# EasyEDA Pro project ACAC.eprj

# Schematic Schematic1
Board Name: Board1; Create Date: 2025-05-16
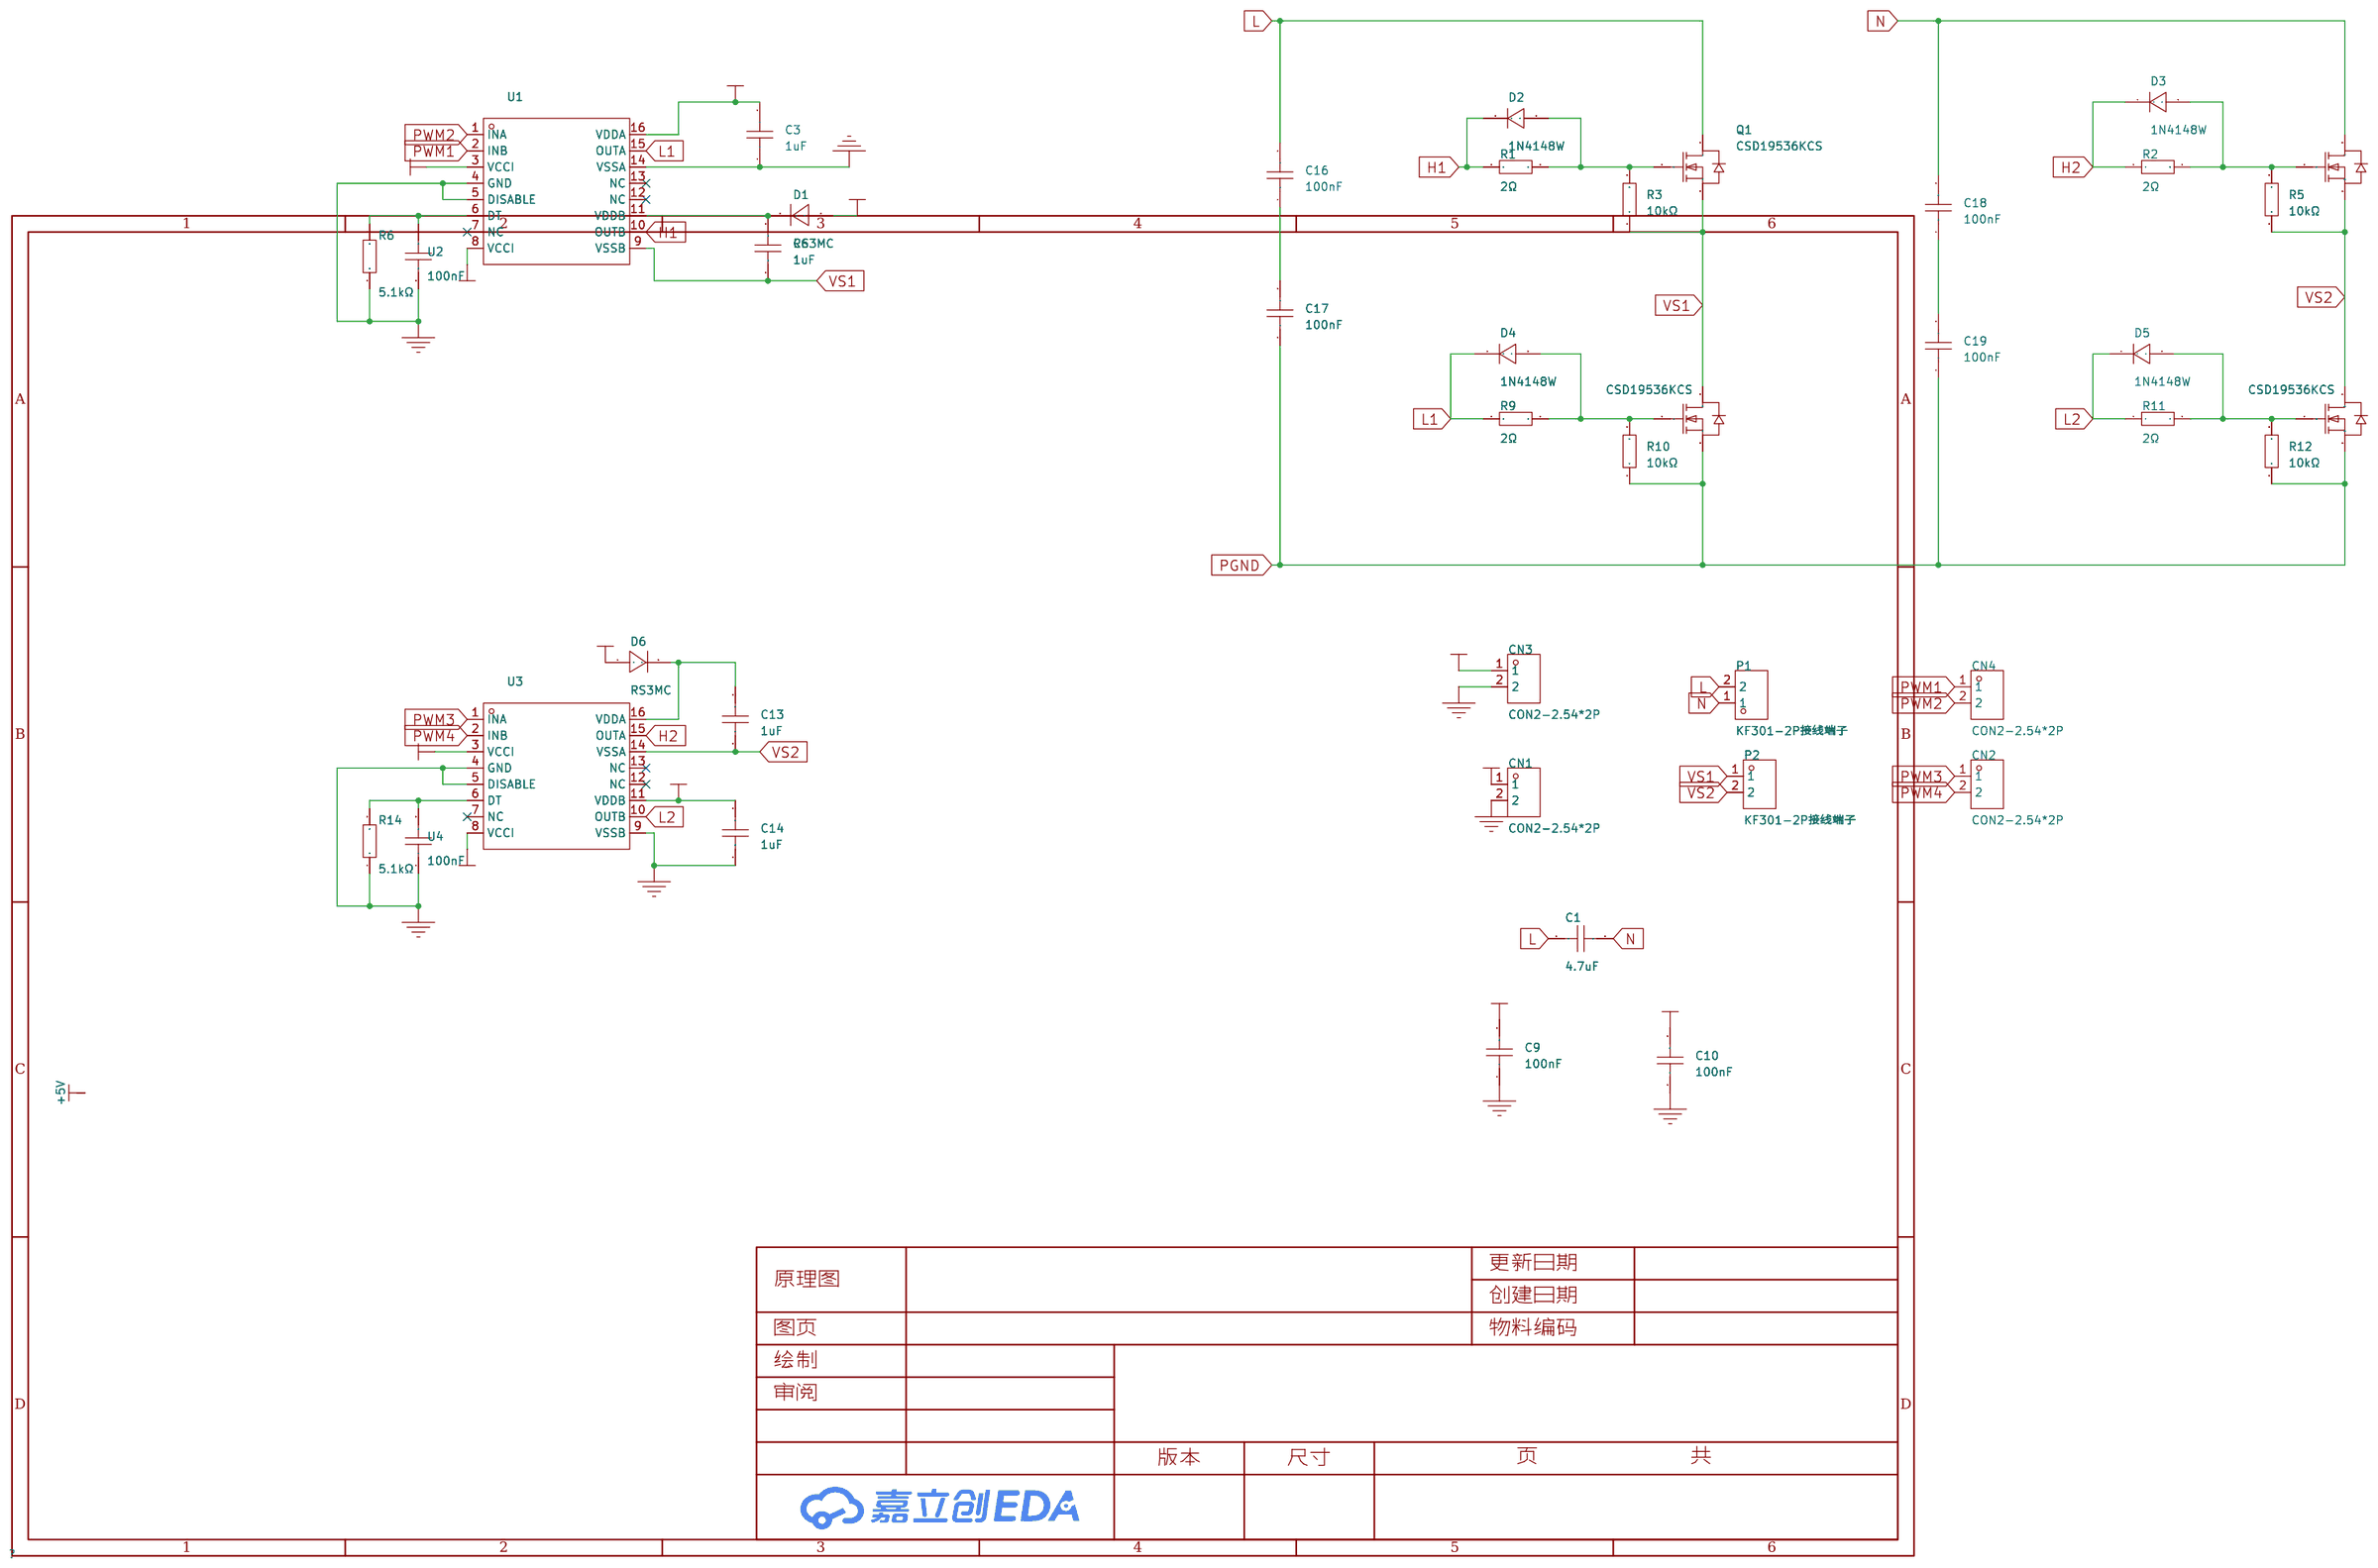
[diagram p0: schematic sheet]

## Parts
C1  4.7uF  [CAP-TH_L27.5-W12.0-P25.00-D1.0]
C3  1uF  [C0805]
C6  1uF  [C0805]
C9  100nF  [C0805]
C10  100nF  [C0805]
C13  1uF  [C0805]
C14  1uF  [C0805]
C16  100nF  [C0805]
C17  100nF  [C0805]
C18  100nF  [C0805]
C19  100nF  [C0805]
CN1  CON2-2.54*2P  [CONN-TH_2P-P2.54-V]
CN2  CON2-2.54*2P  [CONN-TH_2P-P2.54-V]
CN3  CON2-2.54*2P  [CONN-TH_2P-P2.54-V]
CN4  CON2-2.54*2P  [CONN-TH_2P-P2.54-V]
D1  RS3MC  [SMC_L7.1-W6.2-LS8.1-R-RD]
D2  1N4148W  [SOD-123F_L2.7-W1.6-LS3.8-RD]
D3  1N4148W  [SOD-123F_L2.7-W1.6-LS3.8-RD]
D4  1N4148W  [SOD-123F_L2.7-W1.6-LS3.8-RD]
D5  1N4148W  [SOD-123F_L2.7-W1.6-LS3.8-RD]
D6  RS3MC  [SMC_L7.1-W6.2-LS8.1-R-RD]
P1  KF301-2P接线端子  [CONN-TH_XY301V-A-5.0-2P]
P2  KF301-2P接线端子  [CONN-TH_XY301V-A-5.0-2P]
Q1  CSD19536KCS  [TO-220-3_L10.0-W4.5-P2.54-L]
Q2  CSD19536KCS  [TO-220-3_L10.0-W4.5-P2.54-L]
Q3  CSD19536KCS  [TO-220-3_L10.0-W4.5-P2.54-L]
Q4  CSD19536KCS  [TO-220-3_L10.0-W4.5-P2.54-L]
R1  2Ω  [R0805]
R2  2Ω  [R0805]
R3  10kΩ  [R0805]
R5  10kΩ  [R0805]
R6  20kΩ  [R0805]
R9  2Ω  [R0805]
R10  10kΩ  [R0805]
R11  2Ω  [R0805]
R12  10kΩ  [R0805]
R14  20kΩ  [R0805]
U1  UCC21520  [SOIC-16_L10.3-W7.5-P1.27-LS10.3-BL]
U2  100nF  [C0805]
U3  UCC21520  [SOIC-16_L10.3-W7.5-P1.27-LS10.3-BL]
U4  100nF  [C0805]

## Library data of the parts
C1 = KP475K2G2501: 容值:4.7uF;精度:±10%;额定电压:400V;工作温度:-40℃~+100℃;; LCSC Part Name: 4.7uF ±10% 400V; Supplier Part: C3019079; Manufacturer: KYET(科雅); Supplier Footprint: 插件,P=25mm; JLCPCB Part Class: 扩展库; Datasheet: https://atta.szlcsc.com/upload/public/pdf/source/20220523/87D483915523636C76AB2708979E5C62.pdf; Supplier: LCSC; Tolerance: ±10%; Voltage Rating: 400V; Operating Temperature: -40℃~+100℃
C3 C6 C9 C10 C13 C14 C16-C19 = CAP_0805: Supplier Footprint: 0805
CN1-CN4 = CON2-2.54*2P: Supplier Part: C9900003238; Supplier Footprint: TH-2P; JLCPCB Part Class: Extended Part; Supplier: LCSC
D1 D6 = RS3MC_C15283: 二极管配置:独立式;正向压降(Vf):1.3V@3A;直流反向耐压(Vr):1kV;整流电流:3A;反向恢复时间(trr):500ns;; LCSC Part Name: 电压:1kV 电流:3A; Supplier Part: C15283; Manufacturer: MDD(辰达半导体); Supplier Footprint: SMC; JLCPCB Part Class: 扩展库; Datasheet: https://atta.szlcsc.com/upload/public/pdf/source/20240809/311FA8487617F5AA976E3BC15CA3A541.pdf; Supplier: LCSC; Diode Configuration: 独立式; Forward Voltage (Vf@If): 1.3V@3A; Reverse Voltage (Vr): 1kV; Rectified Current: 3A; Reverse Leakage Current: 5uA@1kV; Reverse Recovery Time (trr): 500ns; Operating Temperature: -55℃~+150℃@(Tj)
D2-D5 = 1N4148W_C81598: 二极管配置:独立式;正向压降(Vf):1V@50mA;直流反向耐压(Vr):75V;平均整流电流(Io):150mA;功率:400mW;反向恢复时间(trr):4ns;; LCSC Part Name: 电压:75V 电流:150mA; Supplier Part: C81598; Manufacturer: ST(先科); Supplier Footprint: SOD-123; JLCPCB Part Class: Basic Part; Datasheet: https://atta.szlcsc.com/upload/public/pdf/source/20161024/1477288446905.pdf; Supplier: LCSC; Diode Configuration: 独立式; Forward Voltage (Vf@If): 1V@50mA; Reverse Voltage (Vr): 75V; Average Rectified Current (Io): 150mA; Power Dissipation: 400mW; Reverse Leakage Current: 1uA@75V; Reverse Recovery Time (trr): 4ns
P1 P2 = KF301-2P接线端子: Supplier Part: C9900016950; Supplier Footprint: CK301-2P; JLCPCB Part Class: Extended Part; Supplier: LCSC
Q1-Q4 = CSD19536KCS: LCSC Part Name: 1个N沟道 耐压:100V 电流:150A; Supplier Part: C206030; Manufacturer: TI(德州仪器); Supplier Footprint: TO-220; JLCPCB Part Class: 扩展库; Datasheet: https://www.ti.com/cn/lit/gpn/csd19536kcs; Supplier: LCSC; Type: 1个N沟道; Drain Source Voltage (Vdss): 100V; Continuous Drain Current (Id): 150A; Power Dissipation (Pd): 375W; Drain Source On Resistance (RDS(on)@Vgs,Id): 2.7mΩ@10V,100A; Gate Threshold Voltage (Vgs(th)@Id): 3.2V@250uA; Total Gate Charge (Qg@Vgs): 153nC@10V; Input Capacitance (Ciss@Vds): 12nF@50V; Operating Temperature: -55℃~+175℃@(Tj)
R1-R3 R5 R9-R12 = Res_AXIAL-1/8W: Supplier Footprint: 轴向引线
R6 R14 = 20kΩ: 电阻类型:金属膜电阻;阻值:20kΩ;精度:±1%;功率:500mW;温度系数:±50ppm/℃;; LCSC Part Name: 金属膜电阻 20kΩ ±1% 500mW; Supplier Part: C173146; Manufacturer: YAGEO(国巨); Manufacturer Part: MFR50SFTE52-20K; Supplier Footprint: 插件,D2.4xL6.3mm; JLCPCB Part Class: 扩展库; Datasheet: https://atta.szlcsc.com/upload/public/pdf/source/20191118/C457825_18355E864DE4965678DC27B0EBC3E21E.pdf; Supplier: LCSC; Type: 金属膜电阻; Tolerance: ±1%; Power(Watts): 500mW; Temperature Coefficient: ±50ppm/℃; Operating Temperature Range: -55℃~+155℃; Origin Footprint 2: RES-TH_BD2.4-L6.3-P10.30-D0.6; Origin Footprint 1: MFR50SFTE52-20K
U1 U3 = UCC21520: Supplier: LCSC; Supplier Part: C601651; Manufacturer: TI(德州仪器); JLCPCB Part Class: Extended Part
U2 U4 = 1C25X7R473K100B: 容值:47nF;精度:±10%;额定电压:100V;温度系数:X7R;; LCSC Part Name: 47nF ±10% 100V; Supplier Part: C1630512; Manufacturer: VISHAY(威世); Supplier Footprint: 插件,P=6.35mm; JLCPCB Part Class: Extended Part; Datasheet: https://atta.szlcsc.com/upload/public/pdf/source/20210701/0CF1A7AD3406E72B391D35880AF61B15.pdf; Supplier: LCSC; Tolerance: ±10%; Voltage Rated: 100V; Temperature Coefficient: X7R

## Nets
+5V: C9.2 CN1.1 U1.3(VCCI) U1.8(VCCI) U3.3(VCCI) U3.8(VCCI)
+12V: C3.2 C10.2 C14.2 CN3.1 D1.1(A) D6.1(A) U1.16(VDDA) U3.11(VDDB)
DGND: C9.1 CN1.2 R6.1 R14.1 U1.4(GND) U1.5(DISABLE) U2.1 U3.4(GND) U3.5(DISABLE) U4.1
PGND: C3.1 C10.1 C14.1 C17.1 C19.1 CN3.2 Q3.3(S) Q4.3(S) R10.1 R12.1 U1.14(VSSA) U3.9(VSSB)
H1: D2.1(K) R1.1 U1.10(OUTB)
H2: D3.1(K) R2.1 U3.15(OUTA)
L: C1.2 C16.2 P1.2 Q1.2(D)
L1: D4.1(K) R9.1 U1.15(OUTA)
L2: D5.1(K) R11.1 U3.10(OUTB)
N: C1.1 C18.2 P1.1 Q2.2(D)
PWM1: CN4.1 U1.2(INB)
PWM2: CN4.2 U1.1(INA)
PWM3: CN2.1 U3.1(INA)
PWM4: CN2.2 U3.2(INB)
VS1: C6.1 P2.1 Q1.3(S) Q3.2(D) R3.1 U1.9(VSSB)
VS2: C13.1 P2.2 Q2.3(S) Q4.2(D) R5.1 U3.14(VSSA)
$1N12835: D4.2(A) Q3.1(G) R9.2 R10.2
$1N12837: D2.2(A) Q1.1(G) R1.2 R3.2
$1N12839: D3.2(A) Q2.1(G) R2.2 R5.2
$1N12841: D5.2(A) Q4.1(G) R11.2 R12.2
$1N12848: R14.2 U3.6(DT) U4.2
$1N12851: C6.2 D1.2(K) U1.11(VDDB)
$1N12856: R6.2 U1.6(DT) U2.2
$1N12866: C13.2 D6.2(K) U3.16(VDDA)
$1N12879: C16.1 C17.2
$1N13030: C18.1 C19.2

Not connected (* = marked no-connect by the designer): U1 7(NC)* 12(NC)* 13(NC)*; U3 7(NC)* 12(NC)* 13(NC)*

# Board PCB1
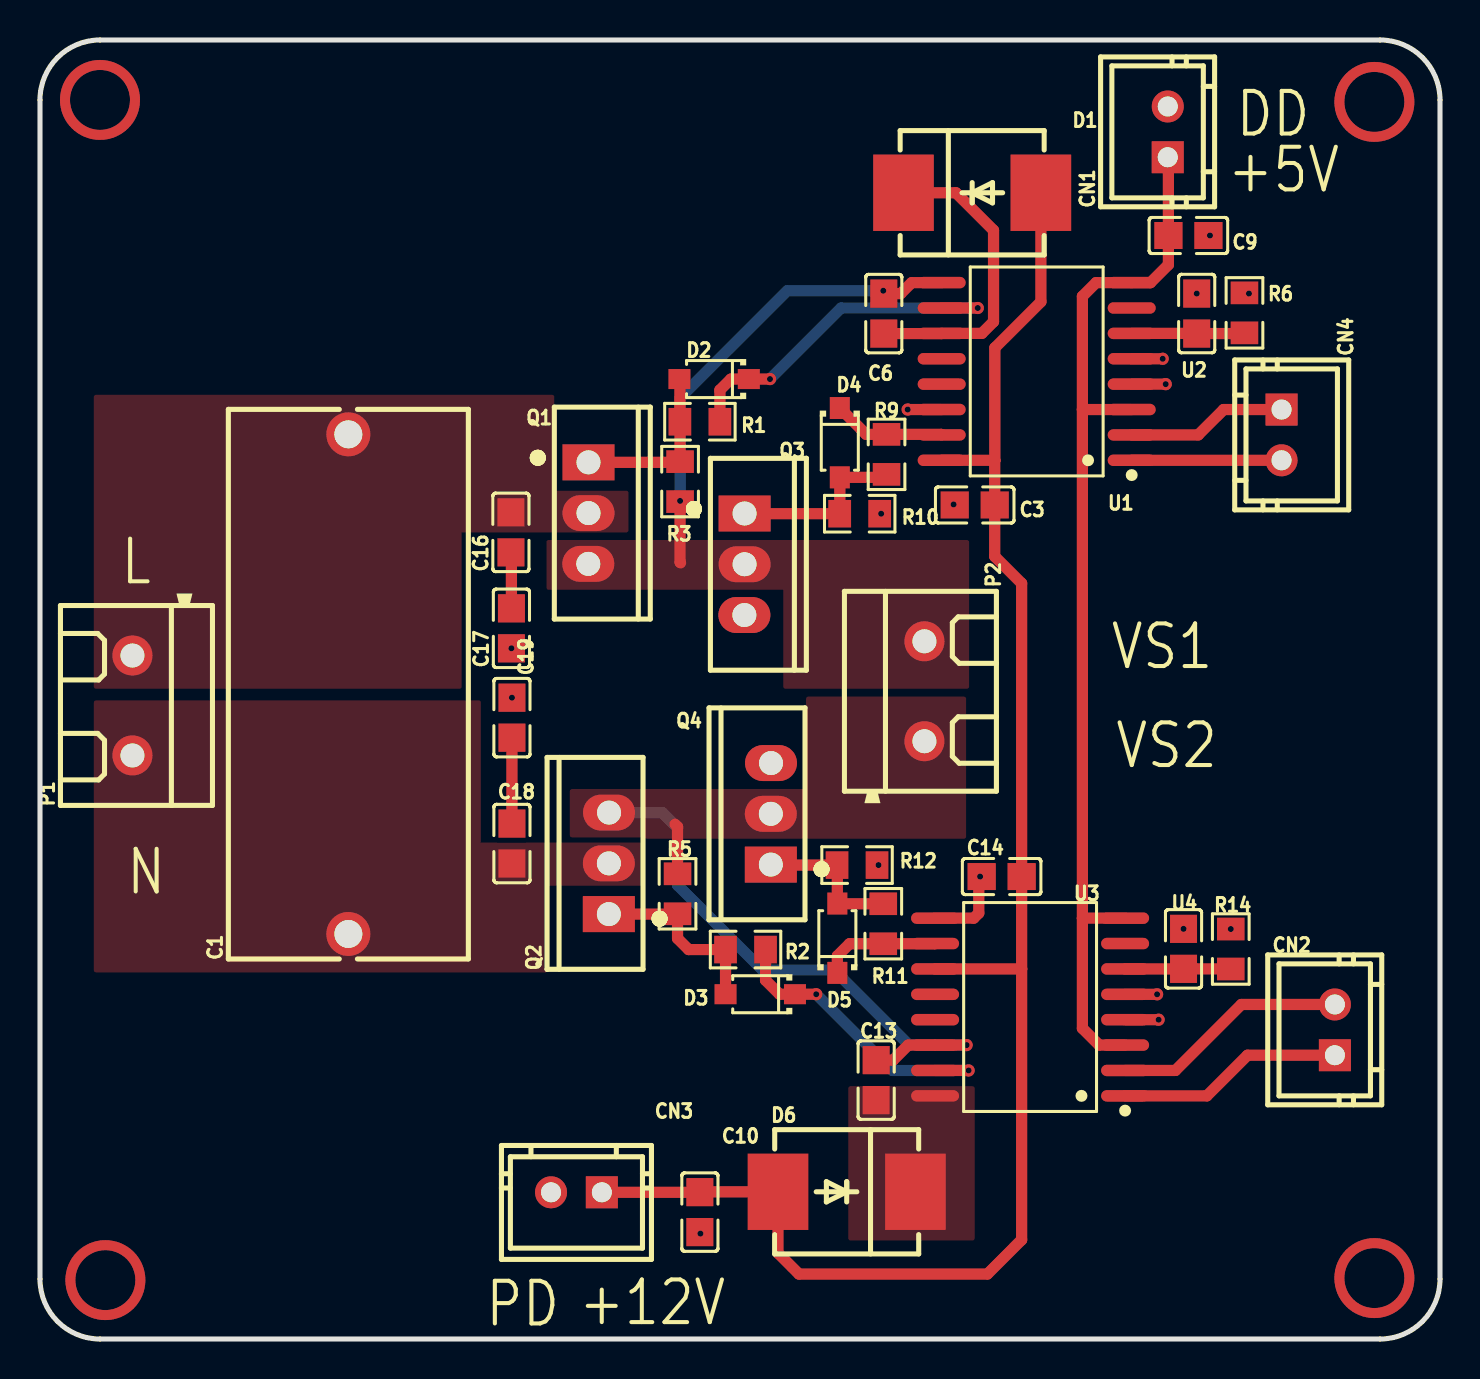
[diagram p1: board, top side]
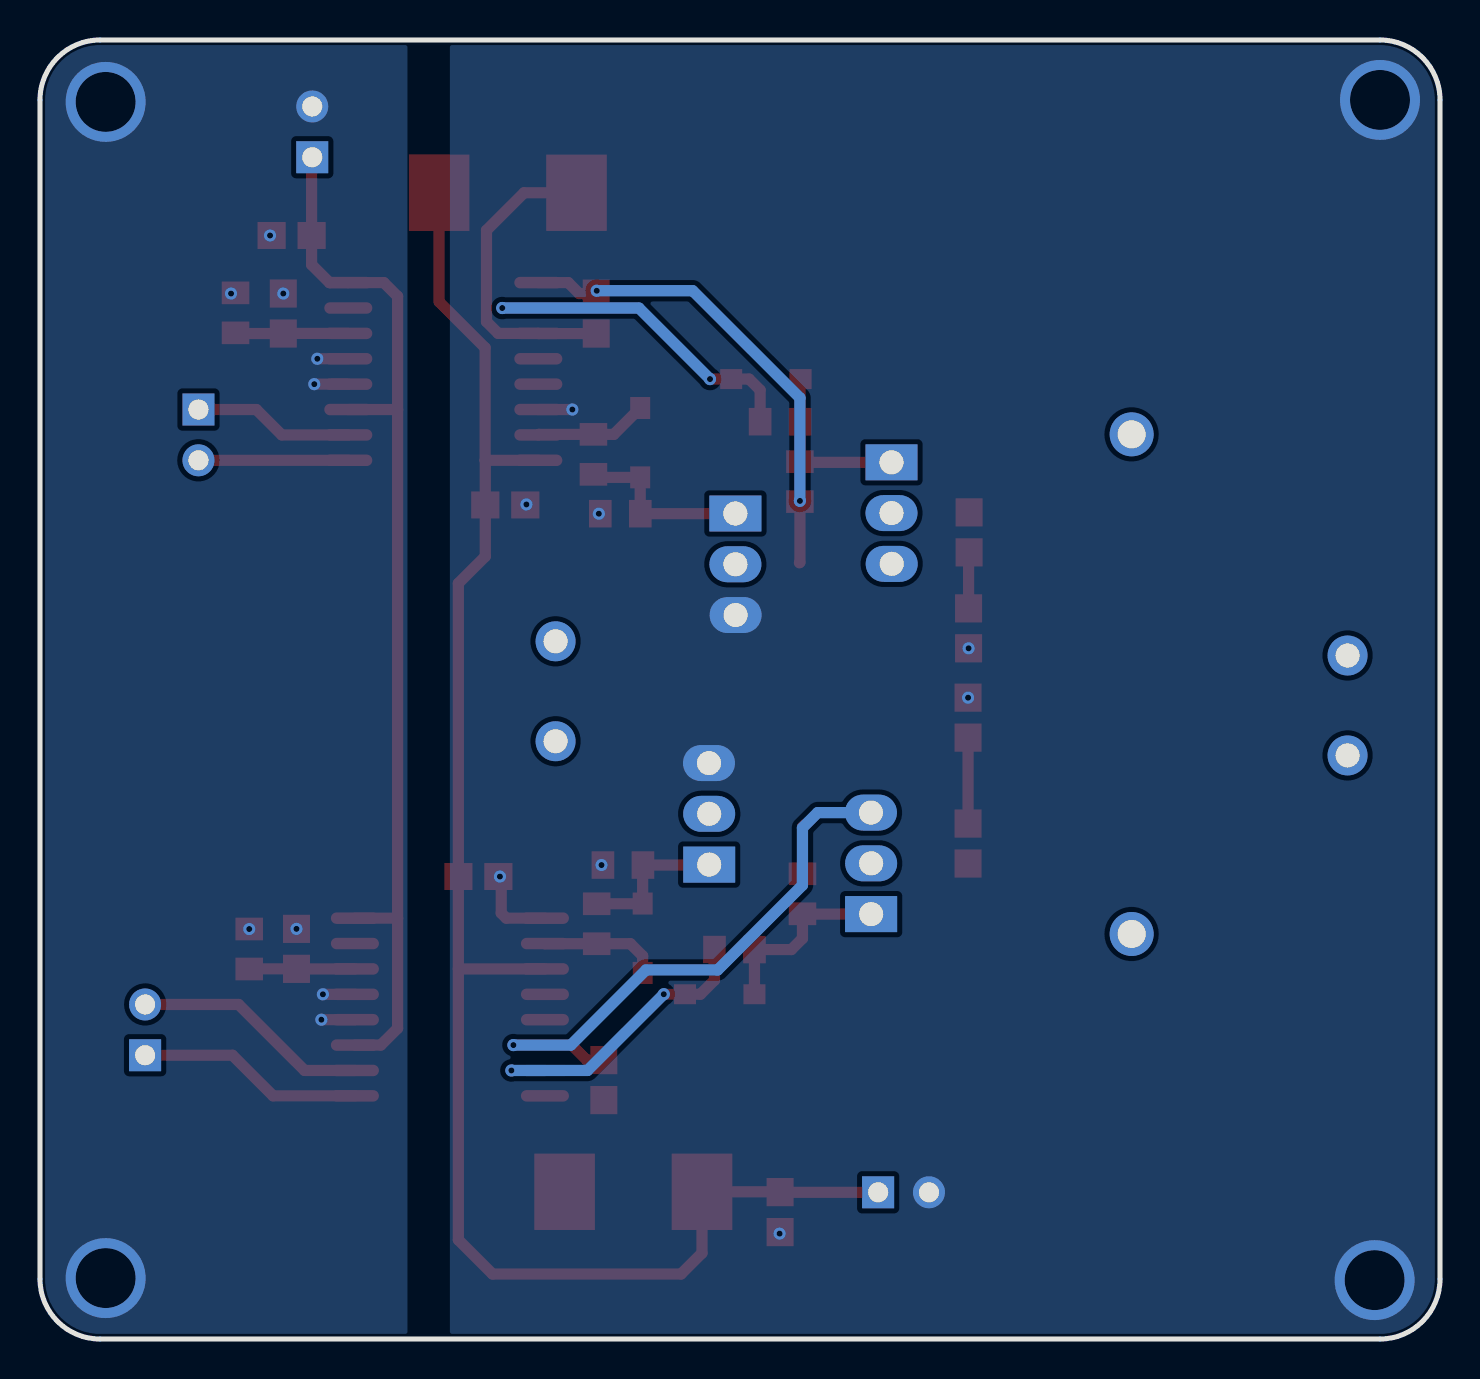
[diagram p2: board, bottom side, seen from below]

Outline 70 x 65 mm; copper layers: Top Layer, Bottom Layer. Coordinates in mm from the lower left corner of the outline.
Outline path: 0,62 0,3 arc(0.88,0.88) 3,0 67,0 arc(69.12,0.88) 70,3 70,62 arc(69.12,64.12) 67,65 3,65 arc(0.88,64.12) 0,62
Stack: Top Layer 0.035mm / Dielectric1 1.51mm FR4 er 4.5 / Bottom Layer 0.035mm

## Design rules (mm)
template: 自定义配置
spacing copperThickness1oz (default): track to track 0.102, other pairs 0.152 to 0.3
spacing copperThickness2oz: track to track 0.203, other pairs 0.152 to 0.3
track width copperThickness1oz (default): min 0.127, default 0.254, max 2.54
track width copperThickness2oz: min 0.203, default 0.254, max 2.54
differential pair differentialPair (default): width min 0.127, default 0.254, max 2.54; gap min 0.152, default 0.152
via viaSize (default): diameter min 0.5, default 0.61, max 10; hole min 0.3, default 0.305, max 6.3

## Placement (name value [footprint] x y rotation side)
C1  4.7uF  [CAP-TH_L27.5-W12.0-P25.00-D1.0]  15.42 32.77 90 top
C3  1uF  [C0805]  46.74 41.73 0 top
C6  1uF  [C0805]  42.19 51.31 270 top
C9  100nF  [C0805]  57.42 55.22 180 top
C10  100nF  [C0805]  32.99 6.35 90 top
C13  1uF  [C0805]  41.81 12.95 270 top
C14  1uF  [C0805]  48.08 23.14 0 top
C16  100nF  [C0805]  23.55 40.36 90 top
C17  100nF  [C0805]  23.57 35.56 90 top
C18  100nF  [C0805]  23.6 24.79 270 top
C19  100nF  [C0805]  23.6 31.09 270 top
CN1  CON2-2.54*2P  [CONN-TH_2P-P2.54-V]  56.39 60.4 90 top
CN2  CON2-2.54*2P  [CONN-TH_2P-P2.54-V]  64.74 15.47 90 top
CN3  CON2-2.54*2P  [CONN-TH_2P-P2.54-V]  26.82 7.34 180 top
CN4  CON2-2.54*2P  [CONN-TH_2P-P2.54-V]  62.08 45.24 270 top
D1  RS3MC  [SMC_L7.1-W6.2-LS8.1-R-RD]  46.61 57.35 0 top
D2  1N4148W  [SOD-123F_L2.7-W1.6-LS3.8-RD]  33.71 48.03 180 top
D3  1N4148W  [SOD-123F_L2.7-W1.6-LS3.8-RD]  36.01 17.25 180 top
D4  1N4148W  [SOD-123F_L2.7-W1.6-LS3.8-RD]  39.99 44.85 270 top
D5  1N4148W  [SOD-123F_L2.7-W1.6-LS3.8-RD]  39.87 20.06 90 top
D6  RS3MC  [SMC_L7.1-W6.2-LS8.1-R-RD]  40.34 7.37 180 top
P1  KF301-2P接线端子  [CONN-TH_XY301V-A-5.0-2P]  4.62 31.7 90 top
P2  KF301-2P接线端子  [CONN-TH_XY301V-A-5.0-2P]  44.22 32.41 270 top
Q1  CSD19536KCS  [TO-220-3_L10.0-W4.5-P2.54-L]  27.42 41.33 270 top
Q2  CSD19536KCS  [TO-220-3_L10.0-W4.5-P2.54-L]  28.45 23.8 90 top
Q3  CSD19536KCS  [TO-220-3_L10.0-W4.5-P2.54-L]  35.22 38.77 270 top
Q4  CSD19536KCS  [TO-220-3_L10.0-W4.5-P2.54-L]  36.55 26.28 90 top
R1  2Ω  [R0805]  32.99 45.9 180 top
R2  2Ω  [R0805]  35.28 19.49 180 top
R3  10kΩ  [R0805]  32 42.9 90 top
R5  10kΩ  [R0805]  31.88 22.28 270 top
R6  20kΩ  [R0805]  60.22 51.35 270 top
R9  2Ω  [R0805]  42.33 44.27 270 top
R10  10kΩ  [R0805]  40.99 41.3 180 top
R11  2Ω  [R0805]  42.16 20.78 90 top
R12  10kΩ  [R0805]  40.85 23.72 180 top
R14  20kΩ  [R0805]  59.54 19.51 270 top
U1  UCC21520  [SOIC-16_L10.3-W7.5-P1.27-LS10.3-BL]  49.83 48.41 90 top
U2  100nF  [C0805]  57.84 51.31 270 top
U3  UCC21520  [SOIC-16_L10.3-W7.5-P1.27-LS10.3-BL]  49.5 16.61 90 top
U4  100nF  [C0805]  57.18 19.52 270 top

## Footprints (pads in the part's own frame, mm; a bottom-side part is the same pattern mirrored in y, then rotated)
C0805
  rect 1.41x1.35 smd: 1(-1,0) 2(1,0)
CAP-TH_L27.5-W12.0-P25.00-D1.0
  round 2.2 hole 1.4: 1(-12.5,0) 2(12.5,0)
CONN-TH_2P-P2.54-V
  rect 1.6x1.6 hole 1: 1(-1.27,0)
  round 1.6 hole 1: 2(1.27,0)
CONN-TH_XY301V-A-5.0-2P
  round 2 hole 1.2: 1(-2.5,0) 2(2.5,0)
R0805
  rect 1.133x1.377 smd: 1(-1,0) 2(1,0)
SMC_L7.1-W6.2-LS8.1-R-RD
  rect 3.03x3.82 smd: 1(3.435,0) 2(-3.435,0)
SOD-123F_L2.7-W1.6-LS3.8-RD
  rect 1.1x1 smd: 1(-1.735,0) 2(1.735,0)
SOIC-16_L10.3-W7.5-P1.27-LS10.3-BL
  oval 0.574x2.401 smd: 1(-4.445,-4.75) 2(-3.175,-4.75) 3(-1.905,-4.75) 4(-0.635,-4.75) 5(0.635,-4.75) 6(1.905,-4.75) 7(3.175,-4.75) 8(4.445,-4.75) 9(4.445,4.75) 10(3.175,4.75) 11(1.905,4.75) 12(0.635,4.75) 13(-0.635,4.75) 14(-1.905,4.75) 15(-3.175,4.75) 16(-4.445,4.75)
TO-220-3_L10.0-W4.5-P2.54-L
  rect 1.8x2.6 hole 1.2: 1(-2.54,0.005)
  oval 1.8x2.6 hole 1.2: 2(0,0.005) 3(2.54,-0.005)

## Nets
As in the schematic.

Pads without a net: U1 7 12 13; U3 7 12 13

## Via types
v1: diameter 0.61, hole 0.305, Top Layer to Bottom Layer, 24 vias
v2: diameter 4, hole 3, Top Layer to Bottom Layer, 4 vias

## Routing (per net, layer and track width the routed paths; a pad name or vN(x,y) marks a point on that pad's centre or on a via; arc(x,y) is an arc through that point)
+5V: length 54.1
  Top Layer w0.559: 52.12,46.51 52.12,52.17 52.81,52.86 U1.8 55.52,52.86 56.42,53.75 C9.2 56.42,59.1 CN1.1 ; 52.12,46.51 U1.3 ; 52.12,46.51 52.12,21.06 ; 52.12,21.06 54.25,21.06 ; 52.12,21.06 52.12,15.55 52.96,14.71 54.25,14.71
+12V: length 86.1
  Top Layer w0.559: 49.08,18.52 49.08,4.96 47.37,3.25 37.95,3.25 36.9,4.3 D6.1 33.01,7.37 C10.2 32.98,7.34 CN3.1 ; 49.08,18.52 C14.2 49.08,37.81 47.74,39.16 C3.2 47.74,43.96 47.74,43.97 ; 49.08,18.52 U3.11 ; 47.74,43.97 U1.16 ; 47.74,43.97 47.74,49.6 50.04,51.9 D1.1
DGND: length 6.5
  Top Layer w0.559: U1.5 v1(56.13,49.05) ; 54.25,17.25 v1(55.85,17.25) ; 54.25,15.98 v1(55.93,15.98) ; U1.4 v1(56.29,47.78)
  vias: v1(57.18,20.52) v1(57.84,52.31) v1(58.5,55.22) v1(59.54,20.51) v1(60.45,52.31) v2(66.72,61.9) v2(66.72,3.05)
PGND: length 5.9
  Top Layer w0.559: U1.14 v1(43.38,46.51) ; C14.1 46.94,23 46.94,21.31 46.69,21.06 U3.9
  vias: v1(23.57,34.56) v1(23.6,32.09) v1(33.02,5.27) v1(41.92,23.72) v1(42.06,41.3) v1(45.68,41.76) v1(47,23.14) v2(3,62) v2(3.27,2.95)
H1: length 18
  Top Layer w0.559: v1(46.89,51.59) U1.10 ; R1.1 33.99,47.48 34.54,48.03 D2.1 v1(36.5,48.03)
  Bottom Layer w0.559: v1(36.5,48.03) 40.06,51.59 v1(46.89,51.59)
H2: length 15.2
  Top Layer w0.559: R2.1 36.28,17.95 36.98,17.25 D3.1 v1(38.81,17.25) ; v1(46.43,13.44) U3.15
  Bottom Layer w0.559: v1(46.43,13.44) 42.63,13.44 v1(38.81,17.25)
L1: length 5.7
  Top Layer w0.559: U1.15 45.06,45.27 R9.1 41.31,45.27 D4.1
L2: length 6
  Top Layer w0.559: U3.10 44.75,19.78 R11.1 40.48,19.78 39.87,19.17 D5.1
PWM1: length 8
  Top Layer w0.559: CN4.1 59.18,46.51 57.91,45.24 U1.2
PWM2: length 7.5
  Top Layer w0.559: CN4.2 U1.1
PWM3: length 11.3
  Top Layer w0.559: 54.25,12.17 58.34,12.17 60.38,14.2 CN2.1
PWM4: length 11.9
  Top Layer w0.559: 64.74,16.74 60.07,16.74 56.77,13.44 54.25,13.44
VS1: length 23.9
  Top Layer w0.559: 32.03,38.84 32,38.86 v1(32,41.94) ; U1.9 43.59,52.86 43.04,52.31 C6.1 42.16,52.33 v1(42.16,52.45)
  Bottom Layer w0.559: v1(32,41.94) 32,47.09 37.36,52.45 v1(42.16,52.45)
VS2: length 31.7
  Top Layer w0.559: v1(46.33,14.71) U3.14 43.41,14.71 42.66,13.95 C13.1 ; 31.75,25.76 31.88,25.63 R5.1
  Bottom Layer w0.559: Q2.3 31.11,26.34 31.88,25.58 31.88,22.71 36.12,18.47 39.7,18.47 43.46,14.71 v1(46.33,14.71)
$1N12835: length 9
  Top Layer w0.559: R9.2 42.18,43.11 D4.2 39.99,41.3 R10.2 35.24,41.3 Q3.1
$1N12837: length 8.7
  Top Layer w0.559: D2.2 31.99,48.01 R1.2 32,45.89 R3.2 31.97,43.87 Q1.1
$1N12839: length 9.5
  Top Layer w0.559: Q2.1 31.86,21.26 R5.2 31.88,20.04 32.43,19.49 R2.2 34.28,17.25
$1N12841: length 7.6
  Top Layer w0.559: R11.2 39.88,21.78 D5.2 39.87,23.7 R12.2 36.56,23.72 Q4.1
$1N12848: length 5.3
  Top Layer w0.559: 54.25,18.52 57.17,18.52 U4.2 59.53,18.52 R14.2
$1N12851: length 15.6
  Top Layer w0.559: D1.2 45.8,57.35 47.68,55.47 47.68,50.9 47.09,50.32 U1.11 45.07,50.31 C6.2
$1N12856: length 5.7
  Top Layer w0.559: U1.6 57.83,50.32 U2.2 60.19,50.31 R6.2
$1N12879: length 2.8
  Top Layer w0.559: C17.2 23.57,39.34 C16.1
$1N13030: length 4.3
  Top Layer w0.559: C19.2 C18.1

## Copper pours and planes (outline as drawn; the poured copper is in the pictures)
DGND on Bottom Layer: 51.63,65 70.03,65 70.03,0.03 51.63,0.03
PGND on Bottom Layer: -0.76,66.09 49.5,66.09 49.5,-0.75 -0.76,-0.75
L on Top Layer: 2.69,32.54 21.08,32.54 21.08,40.36 29.42,40.36 29.42,42.42 29.44,42.44 25.75,42.44 25.72,42.48 25.72,47.24 2.69,47.24
N on Top Layer: 2.69,31.95 22.05,31.95 22.05,24.87 22.02,24.84 30.13,24.84 30.13,22.71 30.1,22.68 25.35,22.68 25.35,18.34 2.69,18.34
VS1 on Top Layer: 25.35,39.98 46.46,39.98 46.46,32.54 37.16,32.54 37.16,37.49 25.32,37.49 25.32,39.95
VS2 on Top Layer: 26.49,25.03 46.3,25.03 46.3,32.14 38.3,32.14 38.3,27.52 26.49,27.52
$1N12866 on Top Layer: 40.41,12.65 46.74,12.65 46.74,4.93 40.41,4.93

## Text on the board
Top Silkscreen Layer: L | N | PD | +12V | VS1 | VS2 | +5V | DD
